# Altium schematic sheet 04 LCD.SchDoc
size 513 x 386 mm
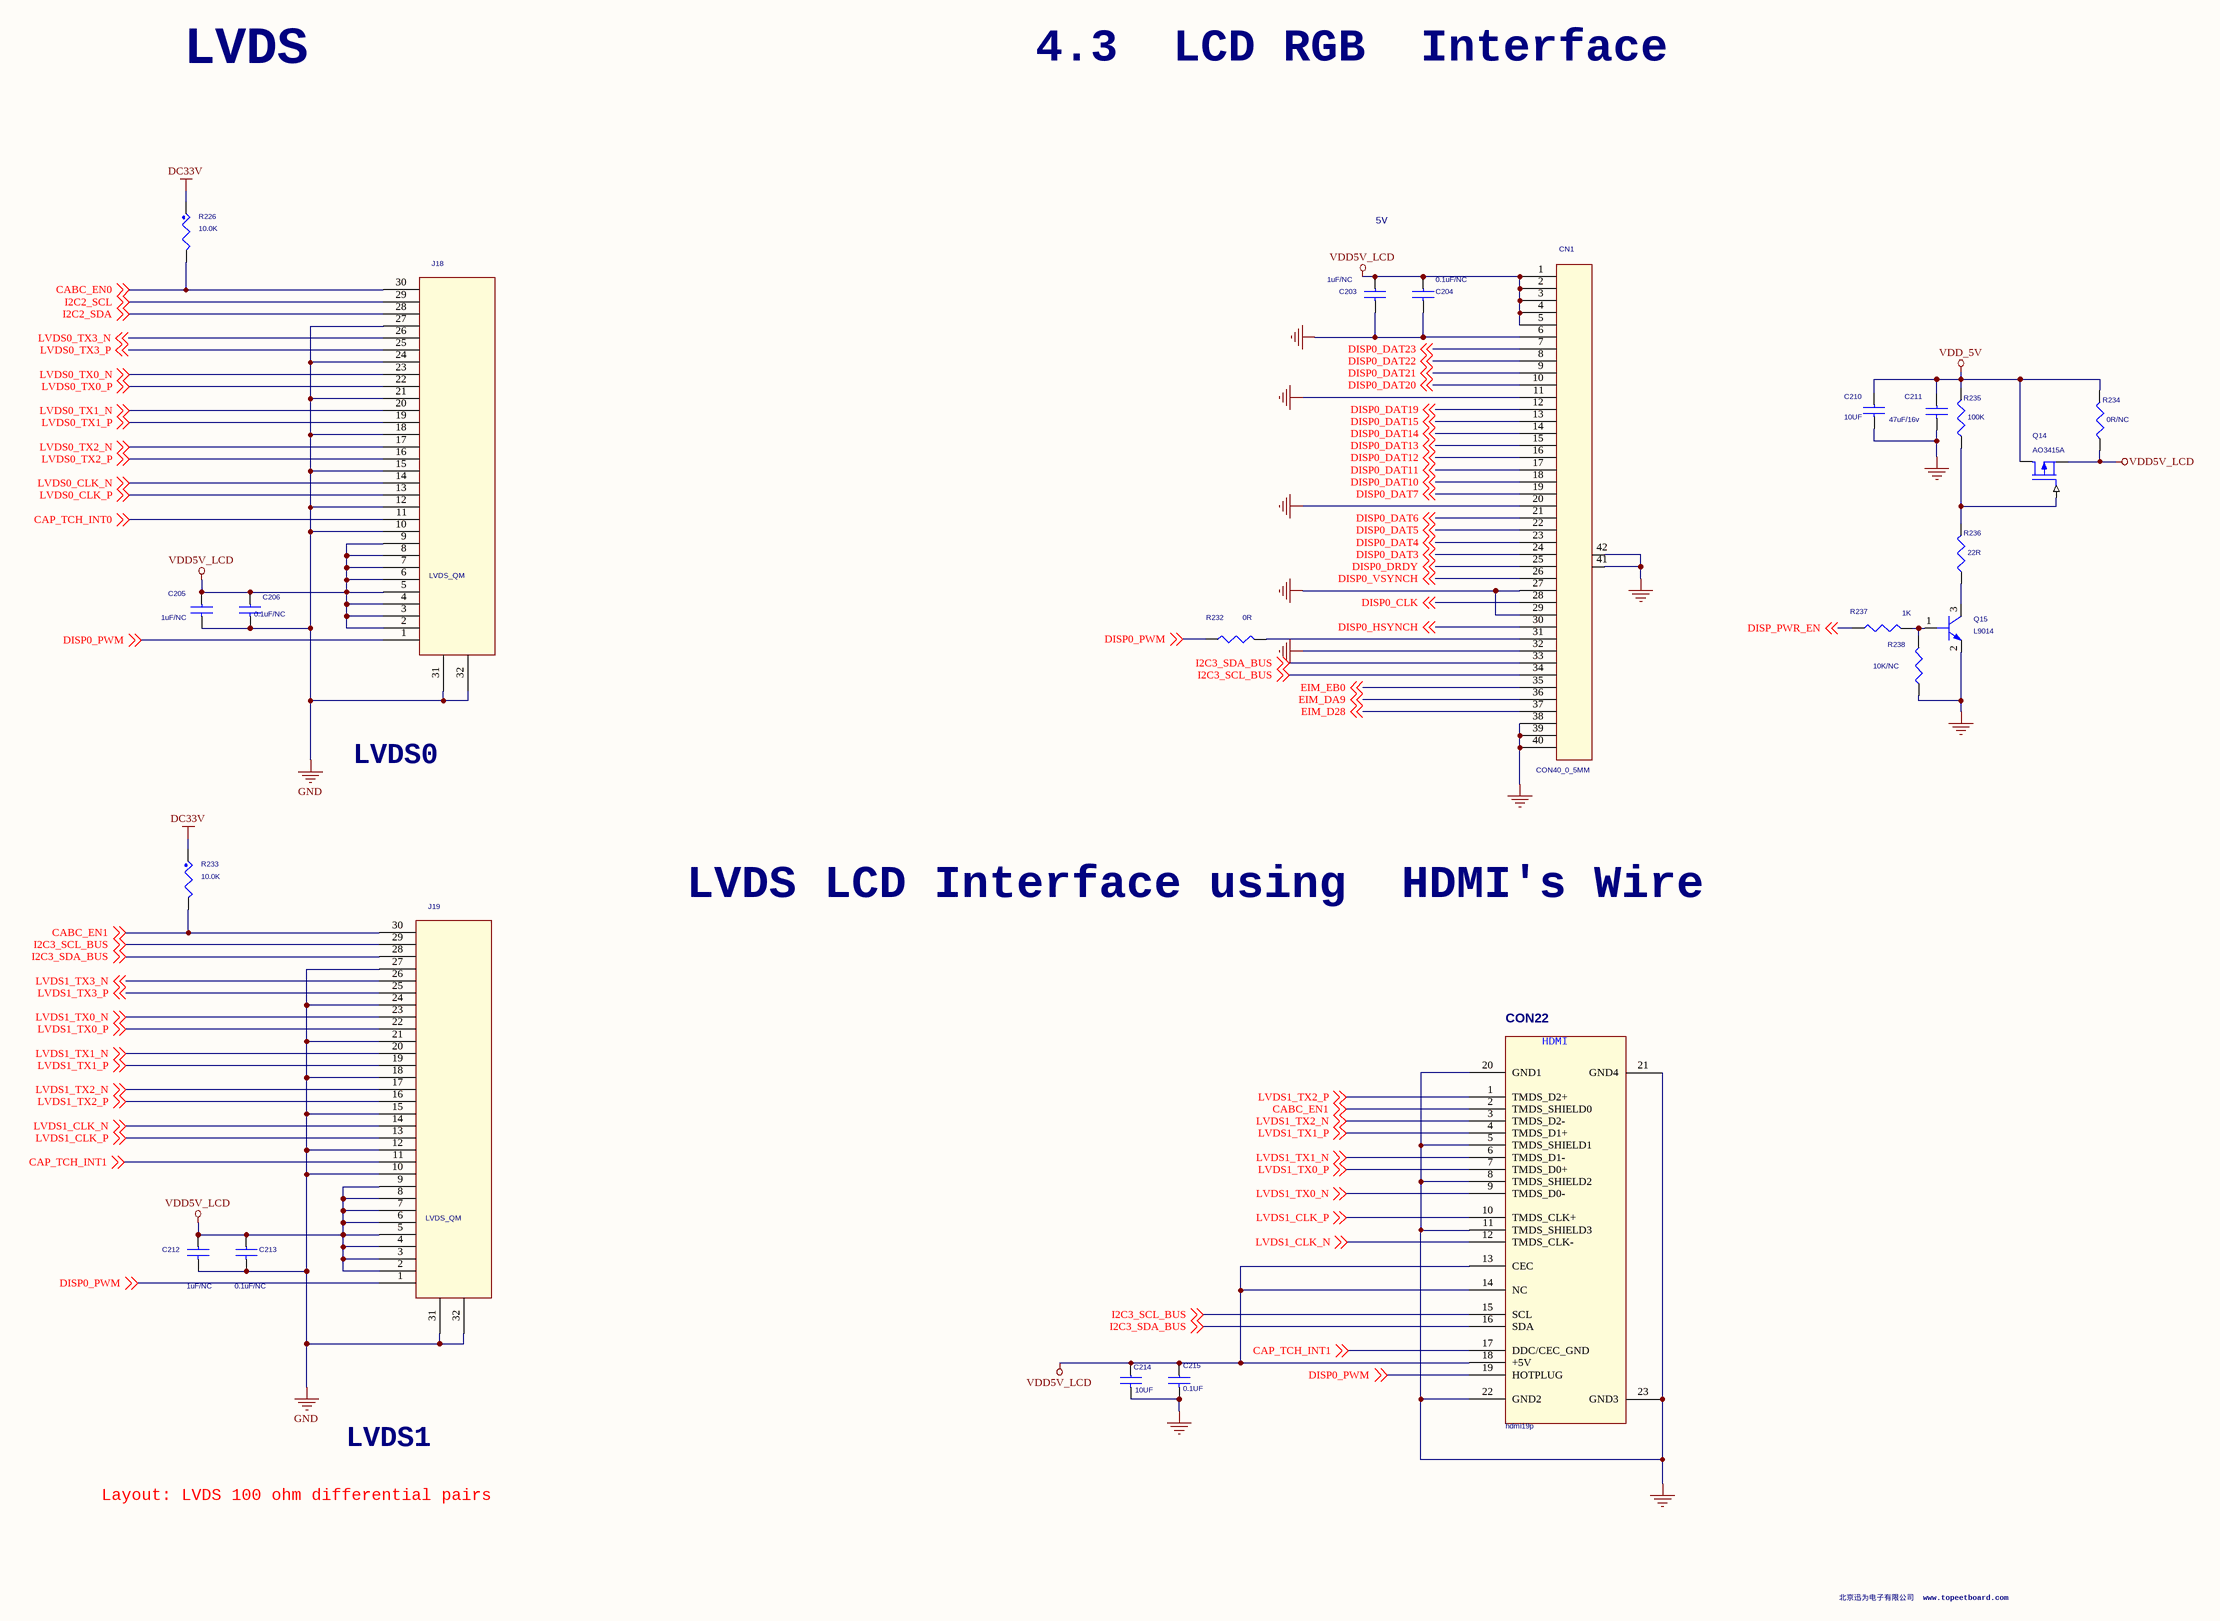
[diagram p0: 04 LCD.SchDoc]

## Parts
C203  1uF/NC  [C0603]
C204  0.1uF/NC  [C0603]
C205  1uF/NC  [C0603]
C206  0.1uF/NC  [C0603]
C210  10UF  [C1608]
C211  47uF/16v  [C1608]
C212  1uF/NC  [C0603]
C213  0.1uF/NC  [C0603]
C214  10UF  [C1608]
C215  0.1UF  [C0402]
CN1  CON40_0_5MM  [CON60_0_5MM]
CON22  hdmi19p  [MD60-19P]
J18  LVDS_QM  [fpc30-050]
J19  LVDS_QM  [fpc30-050]
Q14  AO3415A  [SOT-23]
Q15  L9014  [SOT-23]
R226  10.0K  [R0402]
R232  0R  [R1005]
R233  10.0K  [R0402]
R234  0R/NC  [R1005]
R235  100K  [R1005]
R236  22R  [R1005]
R237  1K  [R1005]
R238  10K/NC  [R1005]

## Nets
DC33V: R226.1 R233.1
GND: C203.2 C204.2 C205.2 C206.2 C210.2 C211.2 C212.2 C213.2 C214.2 C215.2 CN1.6 CN1.11 CN1.20 CN1.27 CN1.29 CN1.32 CN1.38 CN1.39 CN1.40 CN1.41 CN1.42 CON22.5(TMDS_SHIELD1) CON22.8(TMDS_SHIELD2) CON22.11(TMDS_SHIELD3) CON22.20(GND1) CON22.21(GND4) CON22.22(GND2) CON22.23(GND3) J18.10($PIN20) J18.12($PIN18) J18.15($PIN15) J18.18($PIN12) J18.21($PIN9) J18.24($PIN6) J18.27($PIN3) J18.31 J18.32 J19.10($PIN20) J19.12($PIN18) J19.15($PIN15) J19.18($PIN12) J19.21($PIN9) J19.24($PIN6) J19.27($PIN3) J19.31 J19.32 Q15.2(EMITTER) R238.2
VDD5V_LCD: C203.1 C204.1 C205.1 C206.1 C212.1 C213.1 C214.1 C215.1 CN1.1 CN1.2 CN1.3 CN1.4 CN1.5 CON22.13(CEC) CON22.14(NC) CON22.18(+5V) J18.2($PIN29) J18.3($PIN28) J18.4($PIN27) J18.5($PIN26) J18.6($PIN25) J18.7($PIN24) J18.8($PIN22) J18.9($PIN21) J19.2($PIN29) J19.3($PIN28) J19.4($PIN27) J19.5($PIN26) J19.6($PIN25) J19.7($PIN24) J19.8($PIN22) J19.9($PIN21) Q14.3(SOURCE) R234.2
VDD_5V: C210.1 C211.1 Q14.2(DRAIN) R234.1 R235.1
CABC_EN0: J18.30($PIN0) R226.2 ; off-sheet CABC_EN0
CABC_EN1: CON22.2(TMDS_SHIELD0) J19.30($PIN0) R233.2 ; off-sheet CABC_EN1
CAP_TCH_INT0: J18.11($PIN19) ; off-sheet CAP_TCH_INT0
CAP_TCH_INT1: CON22.17(DDC/CEC_GND) J19.11($PIN19) ; off-sheet CAP_TCH_INT1
DISP0_CLK: CN1.28 ; off-sheet DISP0_CLK
DISP0_DAT3: CN1.24 ; off-sheet DISP0_DAT3
DISP0_DAT4: CN1.23 ; off-sheet DISP0_DAT4
DISP0_DAT5: CN1.22 ; off-sheet DISP0_DAT5
DISP0_DAT6: CN1.21 ; off-sheet DISP0_DAT6
DISP0_DAT7: CN1.19 ; off-sheet DISP0_DAT7
DISP0_DAT10: CN1.18 ; off-sheet DISP0_DAT10
DISP0_DAT11: CN1.17 ; off-sheet DISP0_DAT11
DISP0_DAT12: CN1.16 ; off-sheet DISP0_DAT12
DISP0_DAT13: CN1.15 ; off-sheet DISP0_DAT13
DISP0_DAT14: CN1.14 ; off-sheet DISP0_DAT14
DISP0_DAT15: CN1.13 ; off-sheet DISP0_DAT15
DISP0_DAT19: CN1.12 ; off-sheet DISP0_DAT19
DISP0_DAT20: CN1.10 ; off-sheet DISP0_DAT20
DISP0_DAT21: CN1.9 ; off-sheet DISP0_DAT21
DISP0_DAT22: CN1.8 ; off-sheet DISP0_DAT22
DISP0_DAT23: CN1.7 ; off-sheet DISP0_DAT23
DISP0_DRDY: CN1.25 ; off-sheet DISP0_DRDY
DISP0_HSYNCH: CN1.30 ; off-sheet DISP0_HSYNCH
DISP0_PWM: CON22.19(HOTPLUG) J18.1($PIN30) J19.1($PIN30) R232.1 ; off-sheet DISP0_PWM
DISP0_VSYNCH: CN1.26 ; off-sheet DISP0_VSYNCH
DISP_PWR_EN: R237.2 ; off-sheet DISP_PWR_EN
EIM_D28: CN1.37 ; off-sheet EIM_D28
EIM_DA9: CN1.36 ; off-sheet EIM_DA9
EIM_EB0: CN1.35 ; off-sheet EIM_EB0
I2C2_SCL: J18.29($PIN1) ; off-sheet I2C2_SCL
I2C2_SDA: J18.28($PIN2) ; off-sheet I2C2_SDA
I2C3_SCL_BUS: CN1.34 CON22.15(SCL) J19.29($PIN1) ; off-sheet I2C3_SCL_BUS
I2C3_SDA_BUS: CN1.33 CON22.16(SDA) J19.28($PIN2) ; off-sheet I2C3_SDA_BUS
LVDS0_CLK_N: J18.14($PIN16) ; off-sheet LVDS0_CLK_N
LVDS0_CLK_P: J18.13($PIN17) ; off-sheet LVDS0_CLK_P
LVDS0_TX0_N: J18.23($PIN7) ; off-sheet LVDS0_TX0_N
LVDS0_TX0_P: J18.22($PIN8) ; off-sheet LVDS0_TX0_P
LVDS0_TX1_N: J18.20($PIN10) ; off-sheet LVDS0_TX1_N
LVDS0_TX1_P: J18.19($PIN11) ; off-sheet LVDS0_TX1_P
LVDS0_TX2_N: J18.17($PIN13) ; off-sheet LVDS0_TX2_N
LVDS0_TX2_P: J18.16($PIN14) ; off-sheet LVDS0_TX2_P
LVDS0_TX3_N: J18.26($PIN4) ; off-sheet LVDS0_TX3_N
LVDS0_TX3_P: J18.25($PIN5) ; off-sheet LVDS0_TX3_P
LVDS1_CLK_N: CON22.12(TMDS_CLK-) J19.14($PIN16) ; off-sheet LVDS1_CLK_N
LVDS1_CLK_P: CON22.10(TMDS_CLK+) J19.13($PIN17) ; off-sheet LVDS1_CLK_P
LVDS1_TX0_N: CON22.9(TMDS_D0-) J19.23($PIN7) ; off-sheet LVDS1_TX0_N
LVDS1_TX0_P: CON22.7(TMDS_D0+) J19.22($PIN8) ; off-sheet LVDS1_TX0_P
LVDS1_TX1_N: CON22.6(TMDS_D1-) J19.20($PIN10) ; off-sheet LVDS1_TX1_N
LVDS1_TX1_P: CON22.4(TMDS_D1+) J19.19($PIN11) ; off-sheet LVDS1_TX1_P
LVDS1_TX2_N: CON22.3(TMDS_D2-) J19.17($PIN13) ; off-sheet LVDS1_TX2_N
LVDS1_TX2_P: CON22.1(TMDS_D2+) J19.16($PIN14) ; off-sheet LVDS1_TX2_P
LVDS1_TX3_N: J19.26($PIN4) ; off-sheet LVDS1_TX3_N
LVDS1_TX3_P: J19.25($PIN5) ; off-sheet LVDS1_TX3_P
NetCN1_31: CN1.31 R232.2
NetQ14_1: Q14.1(GATE) R235.2 R236.1
NetQ15_1: Q15.1(BASE) R237.1 R238.1
NetQ15_3: Q15.3(COLLECTOR) R236.2

## Notes on the sheet
- LVDS
- 4.3  LCD RGB  Interface
- 5V
- LVDS0
- LVDS LCD Interface using  HDMI's Wire
- LVDS1
- Layout: LVDS 100 ohm differential pairs
- 北京迅为电子有限公司  www.topeetboard.com
- (in symbol MD60-19P_6) HDMI

## Library data of the parts
C203-C206 C212 C213 = C0603_0_Dup1
C210 C211 C214 = C1608_Dup1
C215 = C0402_0
CN1 = CON40_0_1
CON22 = MD60-19P_6
J18 J19 = LVDS_QM_2
Q14 = MOSFET P
Q15 = L14P2/TO_1
R226 R233 = RES_Dup1: RES MF 10.0K 1/16W 1% AEC-Q200 0402; FPLIST: RC0402_25,RC0402_HD,0402_CC; CAD_APPROVED: Yes; ASSY_OPT: DNP; MFG_PN01: RK73H1ETTP1002F; MFG_NAME01: KOA SPEER; AGILE_PN: 470-75416; SIGNAL_MODEL: DEFAULT_RESISTOR_10000OHM_2_1; ROHS: Yes; Tolerance: 1%
R232 R234-R238 = R1005_0_Dup2